# EAGLE design M-Pulse Shield V2 (EAGLE 6.4)
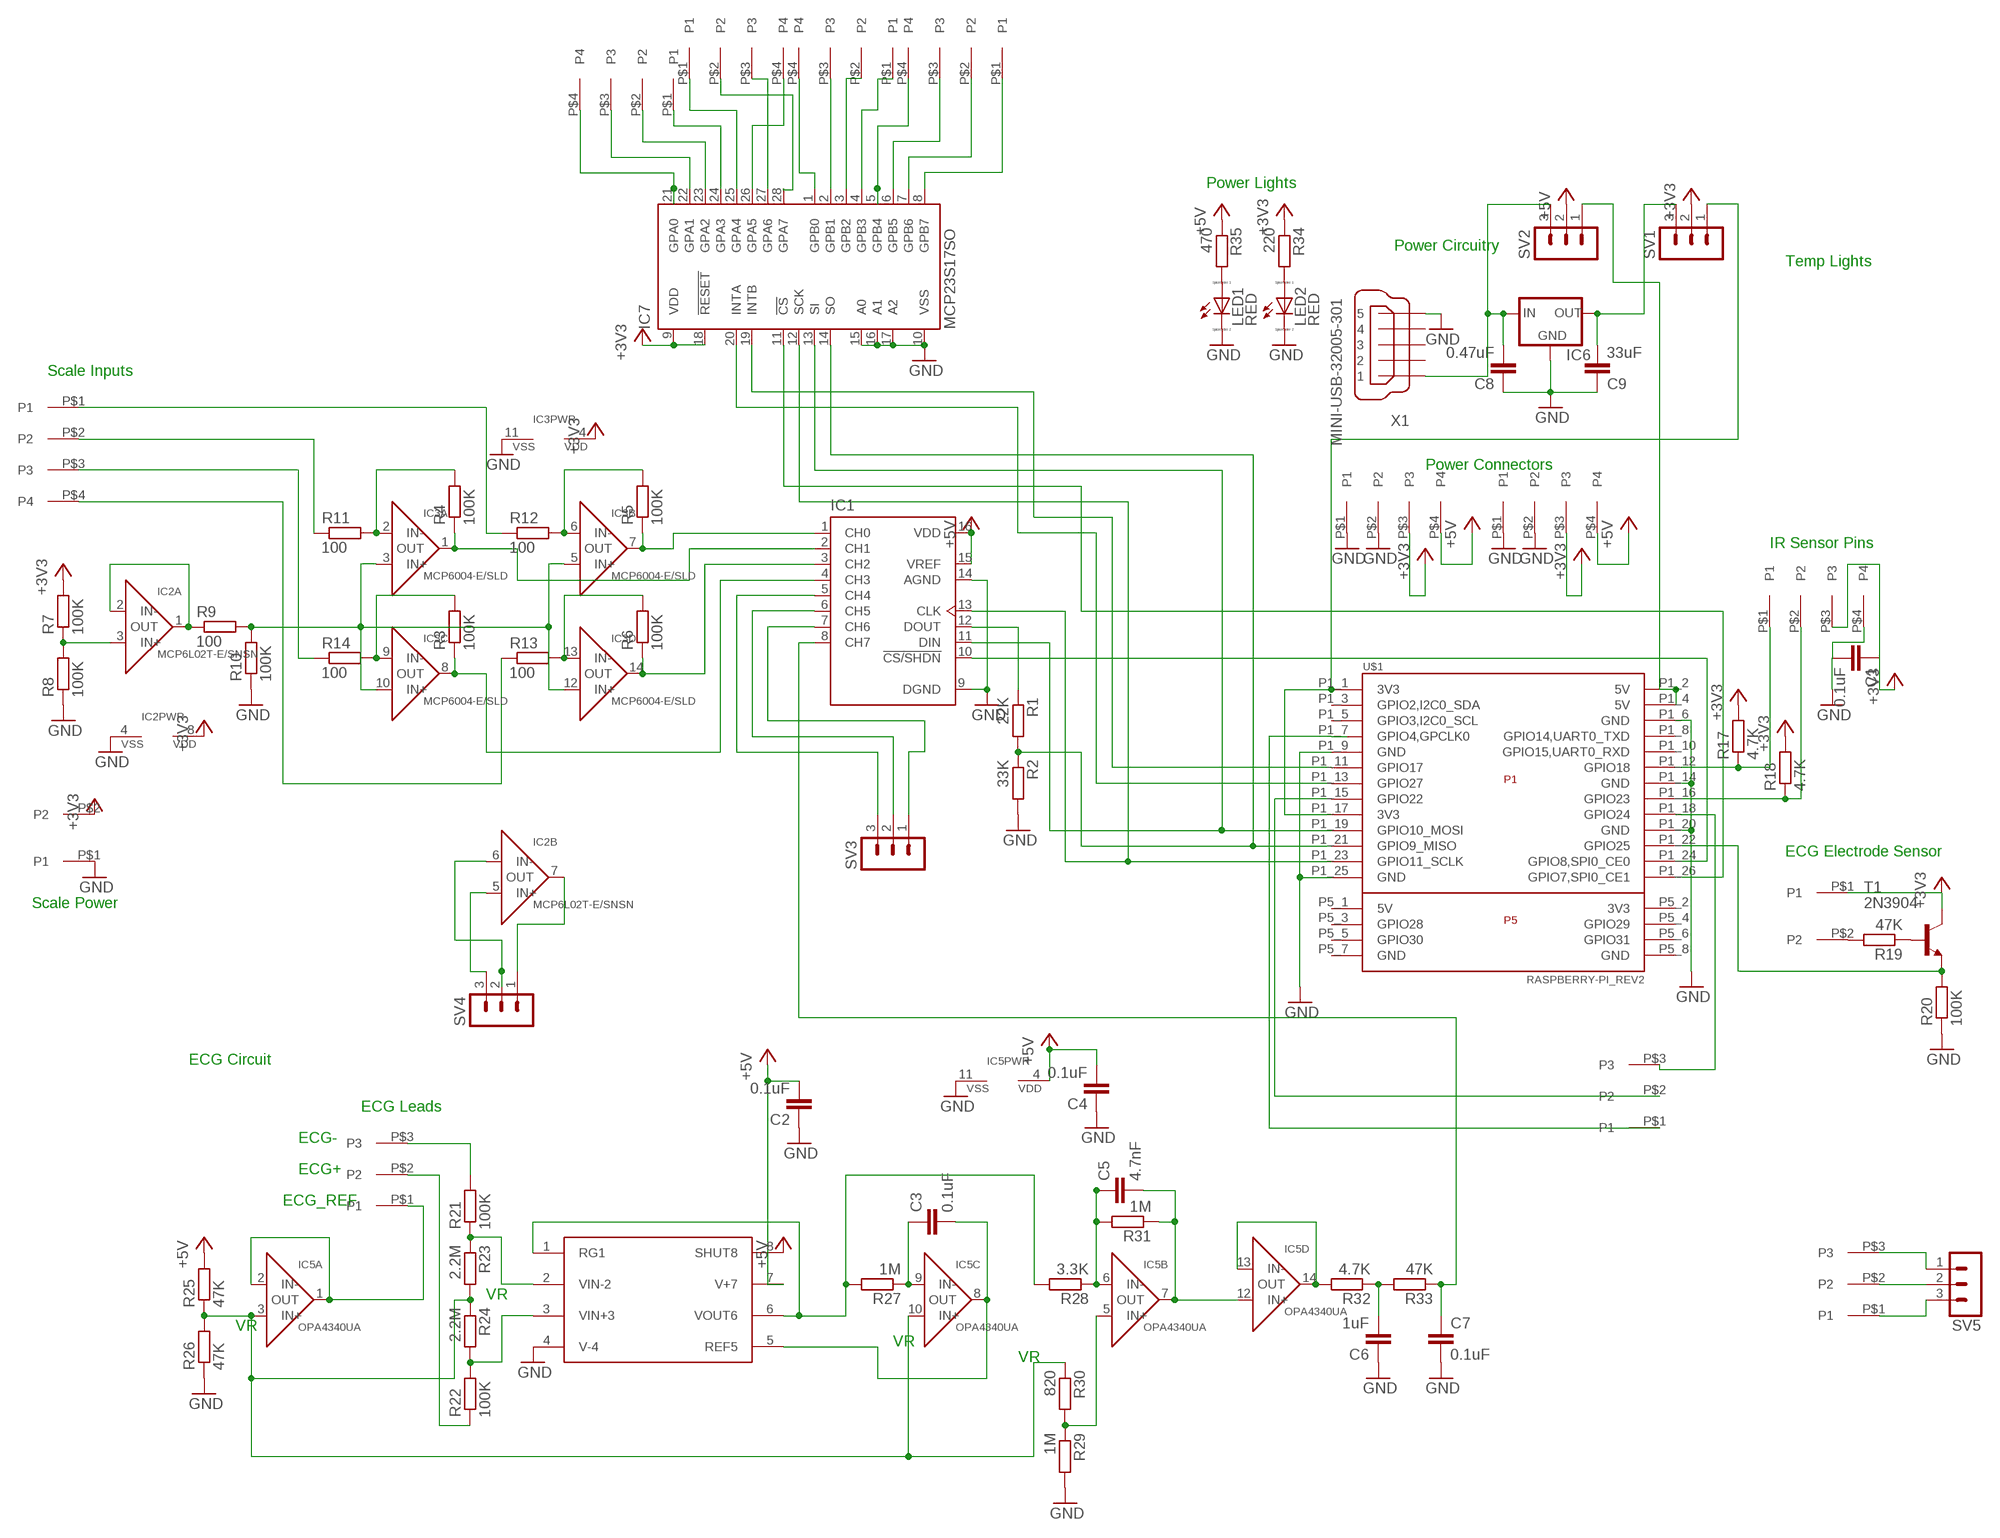
[diagram p0: schematic, sheet 1]

## Parts
C1  0.1uF  C-EUC0603  [C0603]
C2  0.1uF  C-EUC0603  [C0603]
C3  0.1uF  C-EUC0603  [C0603]
C4  0.1uF  C-EUC0603  [C0603]
C5  4.7nF  C-EUC0603  [C0603]
C6  1uF  C-EUC0603  [C0603]
C7  0.1uF  C-EUC0603  [C0603]
C8  0.47uF  C-EUC0603  [C0603]
C9  33uF  C-EUC0603  [C0603]
DIGITALPINS  1776275-3  [1776275-3]
DIGITALPINS1  1776275-3  [1776275-3]
ECG_ES  1776275-2  [1776275-2]
EKGLEADS  1776275-3  [1776275-3]
I/O1  1776275-4  [1776275-4]
I/O2  1776275-4  [1776275-4]
I/O3  1776275-4  [1776275-4]
I/O4  1776275-4  [1776275-4]
IC1  MCP3008  [SOIC16N]
IC2  MCP6L02T-E/SNSN  [SO-08]
IC3  MCP6004-E/SLD  [SO14]
IC4  INA321EAVSSOP-8  [VSSOP-8]
IC5  OPA4340UA  [SO14]
IC6  78XXL  [78XXL]
IC7  MCP23S17SO  [SO28W]
IR_I/O  1776275-4  [1776275-4]
LED1  RED  LED_E  [LED_1206]
LED2  RED  LED_E  [LED_1206]
POWEROUT  1776275-4  [1776275-4]
POWEROUT1  1776275-4  [1776275-4]
R1  22K  R-EU_R0603  [R0603]
R2  33K  R-EU_R0603  [R0603]
R3  100K  R-EU_R0603  [R0603]
R4  100K  R-EU_R0603  [R0603]
R5  100K  R-EU_R0603  [R0603]
R6  100K  R-EU_R0603  [R0603]
R7  100K  R-EU_R0603  [R0603]
R8  100K  R-EU_R0603  [R0603]
R9  100  R-EU_R0603  [R0603]
R10  100K  R-EU_R0603  [R0603]
R11  100  R-EU_R0603  [R0603]
R12  100  R-EU_R0603  [R0603]
R13  100  R-EU_R0603  [R0603]
R14  100  R-EU_R0603  [R0603]
R17  4.7K  R-EU_R0603  [R0603]
R18  4.7K  R-EU_R0603  [R0603]
R19  47K  R-EU_R0603  [R0603]
R20  100K  R-EU_R0603  [R0603]
R21  100K  R-EU_R0603  [R0603]
R22  100K  R-EU_R0603  [R0603]
R23  2.2M  R-EU_R0603  [R0603]
R24  2.2M  R-EU_R0603  [R0603]
R25  47K  R-EU_R0603  [R0603]
R26  47K  R-EU_R0603  [R0603]
R27  1M  R-EU_R0603  [R0603]
R28  3.3K  R-EU_R0603  [R0603]
R29  1M  R-EU_R0603  [R0603]
R30  820  R-EU_R0603  [R0603]
R31  1M  R-EU_R0603  [R0603]
R32  4.7K  R-EU_R0603  [R0603]
R33  47K  R-EU_R0603  [R0603]
R34  220  R-EU_R0603  [R0603]
R35  470  R-EU_R0603  [R0603]
S_IN  1776275-4  [1776275-4]
S_PWR  1776275-2  [1776275-2]
SV1  MA03-1  [MA03-1]
SV2  MA03-1  [MA03-1]
SV3  MA03-1  [MA03-1]
SV4  MA03-1  [MA03-1]
SV5  MA03-1  [MA03-1]
T1  2N3904  [TO92]
U$1  RASPBERRY-PI_REV2  [RASPBERRY-PI_REV2]
X1  MINI-USB-32005-301  [32005-301]

## Nets
+3V3: C1.1 ECG_ES.P$1(P1) IC2.8(PWR:VDD) IC3.4(PWR:VDD) IC7.9(VDD) IC7.18(!RESET) IR_I/O.P$3(P3) POWEROUT1.P$3(P3) POWEROUT.P$3(P3) R7.2 R17.2 R18.2 R34.1 S_PWR.P$2(P2) SV1.2 T1.1(C)
+5V: C2.2 C4.2 IC1.15(VREF) IC1.16(VDD) IC4.7(V+7) IC4.8(SHUT8) IC5.4(PWR:VDD) POWEROUT1.P$4(P4) POWEROUT.P$4(P4) R25.2 R35.1 SV2.2
GND: C1.2 C2.1 C4.1 C6.1 C7.2 C8.1 C9.1 IC1.9(DGND) IC1.14(AGND) IC2.4(PWR:VSS) IC3.11(PWR:VSS) IC4.4(V-4) IC5.11(PWR:VSS) IC6.GND IC7.10(VSS) IC7.15(A0) IC7.16(A1) IC7.17(A2) IR_I/O.P$4(P4) LED1.C LED2.C POWEROUT1.P$1(P1) POWEROUT1.P$2(P2) POWEROUT.P$1(P1) POWEROUT.P$2(P2) R2.2 R8.1 R10.1 R20.1 R26.1 R29.2 S_PWR.P$1(P1) U$1.P1_6(GND) U$1.P1_9(GND) U$1.P1_14(GND) U$1.P1_20(GND) U$1.P1_25(GND) X1.5
N$1: IC7.14(SO) R1.2 R2.1 U$1.P1_21(GPIO9_MISO)
N$2: IC1.13(CLK) IC7.12(SCK) U$1.P1_23(GPIO11_SCLK)
N$3: IC1.12(DOUT) R1.1
N$4: IC1.11(DIN) IC7.13(SI) U$1.P1_19(GPIO10_MOSI)
N$5: IC1.10(!CS/SHDN) U$1.P1_24(GPIO8,SPI0_CE0)
N$6: IC3.3(A:IN+) IC3.5(B:IN+) IC3.10(C:IN+) IC3.12(D:IN+) R9.2 R10.2
N$7: R12.1 S_IN.P$1(P1)
N$8: R11.1 S_IN.P$2(P2)
N$9: IC1.4(CH3) IC3.8(C:OUT) R3.1
N$10: IC1.3(CH2) IC3.14(D:OUT) R6.1
N$11: IC1.2(CH1) IC3.1(A:OUT) R4.1
N$12: I/O1.P$4(P4) IC7.21(GPA0)
N$13: IC3.2(A:IN-) R4.2 R11.2
N$14: IC3.6(B:IN-) R5.2 R12.2
N$15: IC3.13(D:IN-) R6.2 R13.2
N$16: IC3.9(C:IN-) R3.2 R14.2
N$17: R13.1 S_IN.P$4(P4)
N$18: R14.1 S_IN.P$3(P3)
N$19: IC2.3(A:IN+) R7.1 R8.2
N$20: IC2.1(A:OUT) IC2.2(A:IN-) R9.1
N$21: IC2.6(B:IN-) SV4.2
N$22: IC2.5(B:IN+) SV4.3
N$23: IR_I/O.P$1(P1) R17.1 U$1.P1_12(GPIO18)
N$24: IR_I/O.P$2(P2) R18.1 U$1.P1_16(GPIO23)
N$25: R19.1 T1.2(B)
N$26: ECG_ES.P$2(P2) R19.2
N$27: R20.2 T1.3(E) U$1.P1_22(GPIO25)
N$28: IC4.2(VIN-2) R21.1 R23.1
N$29: IC5.13(D:IN-) IC5.14(D:OUT) R32.2
N$30: IC4.3(VIN+3) R22.2 R24.2
N$31: EKGLEADS.P$3(P3) R21.2
N$32: EKGLEADS.P$2(P2) R22.1
N$33: EKGLEADS.P$1(P1) IC5.1(A:OUT) IC5.2(A:IN-)
N$34: C3.1 IC5.9(C:IN-) R27.1
N$35: I/O1.P$1(P1) IC7.24(GPA3)
N$36: IC5.3(A:IN+) IC5.10(C:IN+) R23.2 R24.1 R25.1 R26.2 R30.1
N$37: IC4.1(RG1) IC4.6(VOUT6) R27.2 R28.2
N$38: IC5.5(B:IN+) R29.1 R30.2
N$39: C3.2 IC4.5(REF5) IC5.8(C:OUT)
N$40: C5.1 IC5.6(B:IN-) R28.1 R31.2
N$41: C5.2 IC5.7(B:OUT) IC5.12(D:IN+) R31.1
N$42: C6.2 R32.1 R33.2
N$43: C7.1 IC1.8(CH7) R33.1
N$44: IC1.1(CH0) IC3.7(B:OUT) R5.1
N$45: I/O1.P$2(P2) IC7.23(GPA2)
N$46: I/O1.P$3(P3) IC7.22(GPA1)
N$47: I/O2.P$4(P4) IC7.26(GPA5)
N$48: I/O2.P$1(P1) IC7.25(GPA4)
N$49: I/O2.P$2(P2) IC7.28(GPA7)
N$50: I/O2.P$3(P3) IC7.27(GPA6)
N$51: LED2.A R34.2
N$52: I/O3.P$4(P4) IC7.1(GPB0)
N$53: I/O3.P$3(P3) IC7.2(GPB1)
N$54: I/O3.P$2(P2) IC7.3(GPB2)
N$55: I/O3.P$1(P1) IC7.4(GPB3)
N$56: I/O4.P$4(P4) IC7.5(GPB4)
N$57: I/O4.P$3(P3) IC7.6(GPB5)
N$58: I/O4.P$2(P2) IC7.7(GPB6)
N$60: IC7.19(INTB) U$1.P1_11(GPIO17)
N$61: IC7.20(INTA) U$1.P1_13(GPIO27)
N$62: IC7.11(!CS) U$1.P1_26(GPIO7,SPI0_CE1)
N$63: IC1.5(CH4) SV3.3
N$64: IC1.6(CH5) SV3.2
N$65: IC1.7(CH6) SV3.1
N$66: IC2.7(B:OUT) SV4.1
N$67: DIGITALPINS.P$3(P3) U$1.P1_18(GPIO24)
N$68: DIGITALPINS.P$2(P2) U$1.P1_15(GPIO22)
N$69: DIGITALPINS.P$1(P1) U$1.P1_7(GPIO4,GPCLK0)
N$70: C8.2 IC6.IN SV2.3 X1.1
N$71: SV2.1 U$1.P1_2(5V) U$1.P1_4(5V)
N$72: C9.2 IC6.OUT SV1.3
N$73: SV1.1 U$1.P1_1(3V3) U$1.P1_17(3V3)
N$74: I/O4.P$1(P1) IC7.8(GPB7)
N$75: LED1.A R35.2
N$76: DIGITALPINS1.P$3(P3) SV5.1
N$77: DIGITALPINS1.P$1(P1) SV5.3
N$78: DIGITALPINS1.P$2(P2) SV5.2
Unconnected: U$1.P1_3(GPIO2,I2C0_SDA) U$1.P1_5(GPIO3,I2C0_SCL) U$1.P1_8(GPIO14,UART0_TXD) U$1.P1_10(GPIO15,UART0_RXD) U$1.P5_1(5V) U$1.P5_2(3V3) U$1.P5_3(GPIO28) U$1.P5_4(GPIO29) U$1.P5_5(GPIO30) U$1.P5_6(GPIO31) U$1.P5_7(GND) U$1.P5_8(GND) X1.2 X1.3 X1.4

## Notes on the sheet
- Power Lights
- Power Circuitry
- Temp Lights
- Scale Inputs
- Power Connectors
- IR Sensor Pins
- ECG Electrode Sensor
- Scale Power
- ECG Circuit
- ECG Leads
- ECG-
- ECG+
- ECG_REF
- VR
- VR
- VR
- VR

## Library data of the parts
C1-C9 = resistor:C-EU: CAPACITOR, European symbol
DIGITALPINS DIGITALPINS1 EKGLEADS = mpulseCustom:1776275-3
ECG_ES S_PWR = mpulseCustom:1776275-2
I/O1-I/O4 IR_I/O POWEROUT POWEROUT1 S_IN = mpulseCustom:1776275-4
IC1 = mpulseCustom:MCP3008: Microchip Technology
IC2 = mpulseCustom:MCP6L02T-E/SN: Low-Power, Dual Rail-To-Rail Op-Amp
IC3 = mpulseCustom:MCP6004-E/SL: Quad RR Op-AMP
IC4 = INA321EA:INA321EA
IC5 = mpulseCustom:OPA4340UA
IC6 = v-reg:78XXL: VOLTAGE REGULATOR
IC7 = microchip:MCP23S17: http://ww1.microchip.com/downloads/en/DeviceDoc/21952a.pdf Source: http://ww1.microchip.com/downloads/en/DeviceDoc/21952a.pdf; MF: MICROCHIP; MPN: MCP23S17-E/SO; OC_FARNELL: unknown; OC_NEWARK: 31K2950
LED1 LED2 = eagle-ltspice:LED_E: LED Source: http://www.osram.convergy.de Source: www.luxeon.com Source: www.kingbright.com; SPICEMODEL: NONE; SPICEPREFIX: D; SPICETYPE: diode
R1-R14 R17-R35 = resistor:R-EU_: RESISTOR, European symbol
SV1-SV5 = con-lstb:MA03-1: PIN HEADER; OC_FARNELL: unknown; OC_NEWARK: unknown
T1 = transistor:2N3904: NPN TRANSISTOR
U$1 = RaspberryPi:RASPBERRY-PI_REV2: Raspberry Pi Board <http://www.raspberrypi.org/> Jacques Lagnel V1.0 (beta) 2012 Mateusz Bawaj V1.1 (beta) 2012 Board dimension: Forum 3D model <http://www.raspberrypi.org/forum/general-discussion/mechanical-profile-3d-models?value=3d%20model&type=1&include=1&search=1&ret=all> The GPIO Connector (P1): http://elinux.org/RPi_Low-level_peripherals The GPIO Connector (P5): http://www.raspberrypi-spy.co.uk/2012/09/raspberry-pi-p5-header/
X1 = con-cypressindustries:MINI-USB-: MINI USB-B Conector Source: www.cypressindustries.com; OC_FARNELL: unknown; OC_NEWARK: unknown

## Board
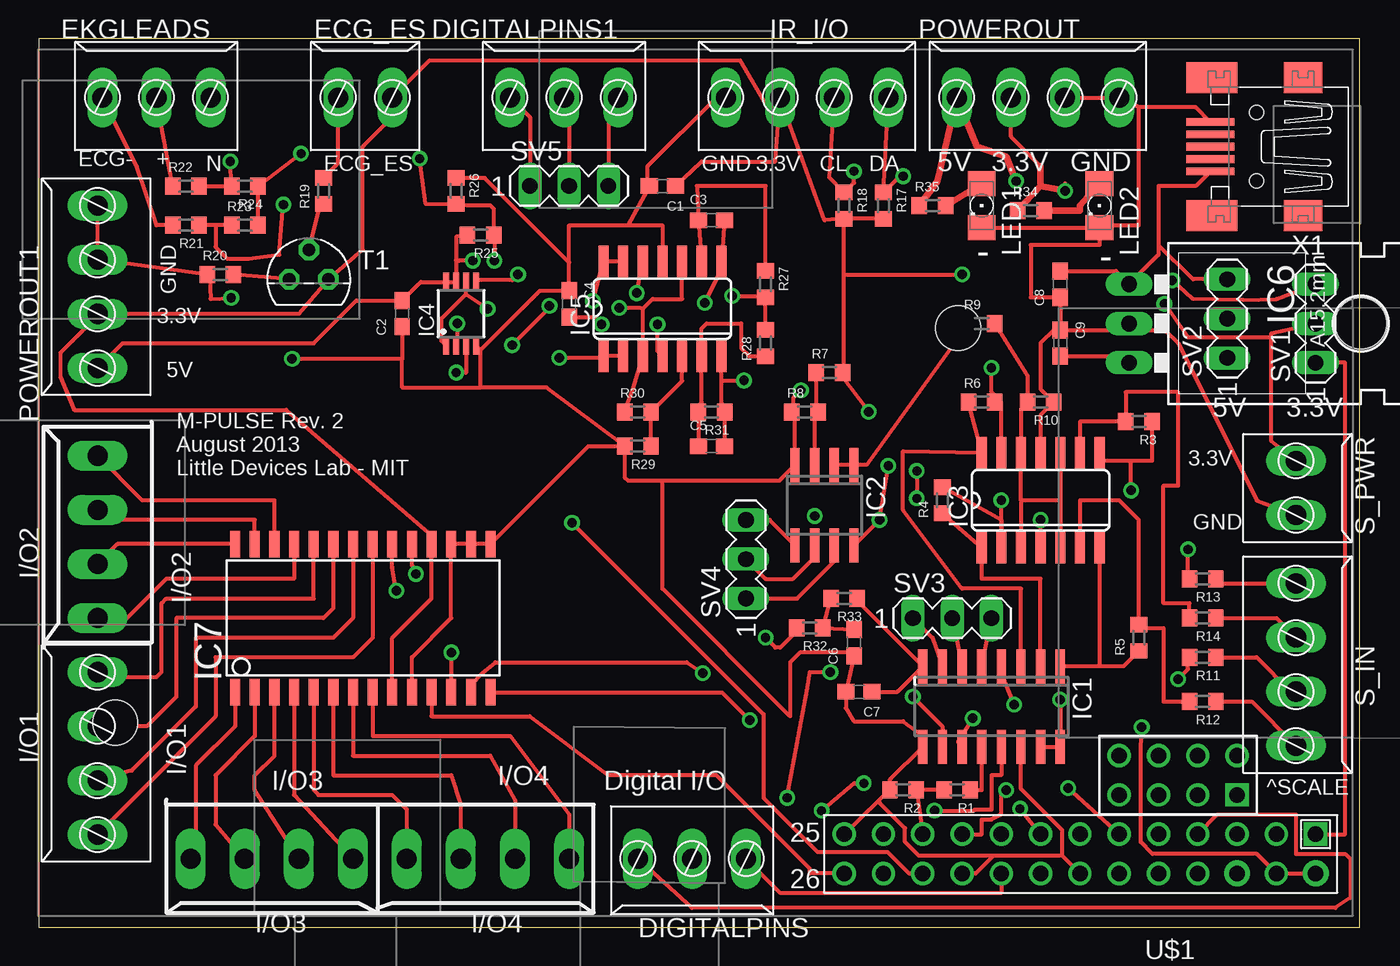
[diagram p1: board, top side]
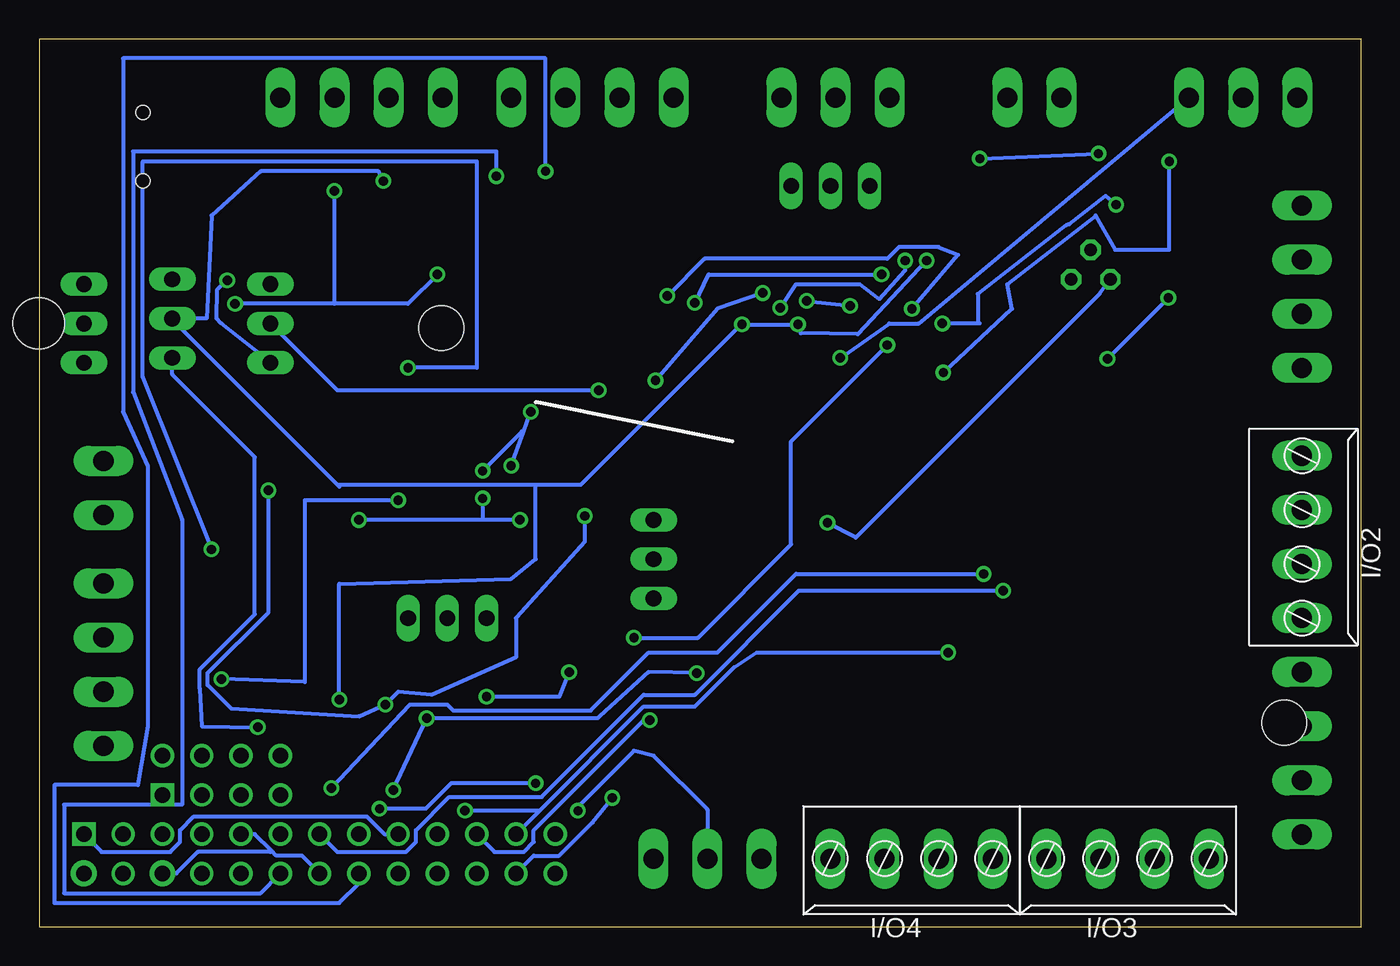
[diagram p2: board, bottom side, seen from below]

Size 85.4 x 57.45 mm. Coordinates in mm from the lower left corner, seen from the top.
Outline: 0,57.45 0,0 85.4,0 85.4,57.45 0,57.45
Copper layers (1*16): Top 0.035mm / dielectric 1.5mm / Bottom 0.035mm
Design rules "default *": minimum track width 10mil, minimum drill 23mil, track to track 10mil, track to pad 10mil, pad to pad 10mil, via to via 10mil, smd to smd 10mil, copper to edge 10mil, drill to drill 10mil, minimum pad ring 10mil, minimum via ring 8mil, stop-mask expansion 4mil, vias tented up to drill 0mil, thermal gap 10mil

### Footprints (pad centres in the part's own frame; a part is rotated, then mirrored left to right if it is on the bottom)
C0603 = smd 1.1 x 1: 1 -0.85,0; 2 0.85,0
1776275-3 = drill 1.3 pad 1.93 long: P$1 0,0; P$2 3.5,0; P$3 7,0
1776275-2 = drill 1.3 pad 1.93 long: P$1 0,0; P$2 3.5,0
1776275-4 = drill 1.3 pad 1.93 long: P$1 0,0; P$2 3.5,0; P$3 7,0; P$4 10.5,0
SOIC16N = smd 0.6 x 2.2: 1 -4.445,-2.6; 2 -3.175,-2.6; 3 -1.905,-2.6; 4 -0.635,-2.6; 5 0.635,-2.6; 6 1.905,-2.6; 7 3.175,-2.6; 8 4.445,-2.6; 9 4.445,2.6; 10 3.175,2.6; 11 1.905,2.6; 12 0.635,2.6; 13 -0.635,2.6; 14 -1.905,2.6; 15 -3.175,2.6; 16 -4.445,2.6
SO-08 = smd 0.6 x 2.2: 1 -1.905,-2.6; 2 -0.635,-2.6; 3 0.635,-2.6; 4 1.905,-2.6; 5 1.905,2.6; 6 0.635,2.6; 7 -0.635,2.6; 8 -1.905,2.6
SO14 = smd 0.66 x 2.032: 1 -3.81,-3.073; 2 -2.54,-3.073; 3 -1.27,-3.073; 4 0,-3.073; 5 1.27,-3.073; 6 2.54,-3.073; 7 3.81,-3.073; 8 3.81,3.073; 9 2.54,3.073; 10 1.27,3.073; 11 0,3.073; 12 -1.27,3.073; 13 -2.54,3.073; 14 -3.81,3.073
VSSOP-8 = smd 1.2 x 0.4: 1 -2.05,0.975; 2 -2.05,0.325; 3 -2.05,-0.325; 4 -2.05,-0.975; 5 2.05,-0.975; 6 2.05,-0.325; 7 2.05,0.325; 8 2.05,0.975
78XXL = drill 1.016 long: GND 0,-3.81; IN -2.54,-3.81; OUT 2.54,-3.81 | hole 3.302: 0,11.176
SO28W = smd 0.65 x 1.7: 1 -7.62,-4.78; 2 -6.35,-4.78; 3 -5.08,-4.78; 4 -3.81,-4.78; 5 -2.54,-4.78; 6 -1.27,-4.78; 7 0,-4.78; 8 1.27,-4.78; 9 2.54,-4.78; 10 3.81,-4.78; 11 5.08,-4.78; 12 6.35,-4.78; 13 7.62,-4.78; 14 8.89,-4.78; 15 8.89,4.78; 16 7.62,4.78; 17 6.35,4.78; 18 5.08,4.78; 19 3.81,4.78; 20 2.54,4.78; 21 1.27,4.78; 22 0,4.78; 23 -1.27,4.78; 24 -2.54,4.78; 25 -3.81,4.78; 26 -5.08,4.78; 27 -6.35,4.78; 28 -7.62,4.78
LED_1206 = smd 1.6 x 1.803: A -1.422,0; C 1.422,0
R0603 = smd 1 x 1.1: 1 -0.85,0; 2 0.85,0
MA03-1 = drill 1.016 long: 1 -2.54,0; 2 0,0; 3 2.54,0
TO92 = drill 0.813 octagon: 1 1.27,0; 2 0,1.905; 3 -1.27,0
RASPBERRY-PI_REV2 = drill 1 square: P1_1 -41.91,21.59; P5_1 -36.83,19.05 | drill 1 pad 1.676: P1_2 -41.91,24.13; P1_6 -36.83,24.13 | drill 1: P1_3 -39.37,21.59; P1_4 -39.37,24.13; P1_5 -36.83,21.59; P1_7 -34.29,21.59; P1_8 -34.29,24.13; P1_9 -31.75,21.59; P1_10 -31.75,24.13; P1_11 -29.21,21.59; P1_12 -29.21,24.13; P1_13 -26.67,21.59; P1_14 -26.67,24.13; P1_15 -24.13,21.59; P1_16 -24.13,24.13; P1_17 -21.59,21.59; P1_18 -21.59,24.13; P1_19 -19.05,21.59; P1_20 -19.05,24.13; P1_21 -16.51,21.59; P1_22 -16.51,24.13; P1_23 -13.97,21.59; P1_24 -13.97,24.13; P1_25 -11.43,21.59; P1_26 -11.43,24.13; P5_2 -36.83,16.51; P5_3 -34.29,19.05; P5_4 -34.29,16.51; P5_5 -31.75,19.05; P5_6 -31.75,16.51; P5_7 -29.21,19.05; P5_8 -29.21,16.51 | hole 2.9: 35.69,14.365; -18.81,-11.135
32005-301 = smd 3.1 x 0.5: 1 3,1.6; 2 3,0.8; 3 3,0; 4 3,-0.8; 5 3,-1.6 | smd 2.5 x 2: M1 -3,-4.45; M2 -3,4.45 | smd 3.3 x 2: M3 2.9,4.45; M4 2.9,-4.45 | hole 0.9: 0,2.2; 0,-2.2

### Placement (x,y rotation side)
C1  40.32,47.93 180 top
C2  23.5,39.67 90 top
C3  43.5,45.71 0 top
C4  34.29,40.31 270 top
C5  43.5,31.1 0 top
C6  52.7,18.4 90 top
C7  53.02,15.23 180 top
C8  66.04,41.58 90 top
C9  66.04,37.77 270 top
DIGITALPINS  38.73,4.43 0 top
DIGITALPINS1  37.47,53.64 180 top
ECG_ES  22.86,53.64 180 top
EKGLEADS  11.11,53.64 180 top
I/O1  3.81,16.5 270 top
I/O2  3.81,19.99 90 bottom
I/O3  20.32,4.43 0 bottom
I/O4  34.29,4.43 0 bottom
IC1  61.6,14.28 180 top
IC2  50.8,27.29 180 top
IC3  64.77,27.61 0 top
IC4  27.3,39.67 90 top
IC5  40.32,39.99 0 top
IC6  74.29,39.04 270 top
IC7  20.32,19.99 0 top
IR_I/O  54.93,53.64 180 top
LED1  60.96,46.66 270 top
LED2  68.58,46.66 270 top
POWEROUT  69.85,53.64 180 top
POWEROUT1  3.81,46.66 270 top
R1  59.37,8.88 180 top
R2  55.88,8.88 180 top
R3  71.12,32.69 180 top
R4  58.42,27.61 90 top
R5  71.12,18.72 90 top
R6  60.96,33.96 0 top
R7  51.12,35.87 0 top
R8  49.53,33.32 0 top
R9  60.96,39.04 0 top
R10  64.77,33.96 180 top
R11  75.25,17.45 180 top
R12  75.25,14.59 180 top
R13  75.25,22.53 180 top
R14  75.25,19.99 180 top
R17  54.61,46.66 270 top
R18  52.07,46.66 270 top
R19  18.41,47.61 90 top
R20  11.75,42.21 0 top
R21  9.52,45.39 180 top
R22  9.52,47.93 0 top
R23  13.34,45.39 0 top
R24  13.34,47.93 180 top
R25  28.57,44.75 180 top
R26  26.99,47.61 270 top
R27  46.99,41.58 270 top
R28  46.99,37.77 90 top
R29  38.73,31.1 180 top
R30  38.73,33.32 0 top
R31  43.5,33.32 180 top
R32  49.85,19.35 180 top
R33  52.07,21.26 180 top
R34  64.13,46.34 0 top
R35  57.79,46.66 0 top
S_IN  81.28,11.74 90 top
S_PWR  81.28,26.66 90 top
SV1  82.55,39.04 90 top
SV2  76.83,39.36 90 top
SV3  59.05,19.99 0 top
SV4  45.72,23.8 90 top
SV5  34.29,47.93 0 top
T1  17.46,41.9 0 top
U$1  40.64,27.61 180 top
X1  78.74,50.47 180 top

### Tracks (layer width: path | path; a pad name or v marks a point on that pad's centre or on a via)
+3V3  (via drill 0.58, 0.6, 0.61)
  Top 0.254: 64.77,49.2 62.85,51.12 POWEROUT.P$3 | R17.2 R18.2 | 52.07,42.21 52.07,35.97 R7.2 51.82,35.74 v53.66,33.32 | 52.07,42.21 R18.2 | S_PWR.P$2 79.69,31.42 79.69,38.15 | 79.69,38.15 79.69,38.41 SV1.2 | R18.2 50.8,45.71 IR_I/O.P$3 | v64.77,26.34 IC3.4 | IC2.8 52.83,24.82 v54.36,26.34 54.93,29.83 | 79.69,38.15 74.29,38.15 v72.77,40.31 | 52.07,42.21 v59.69,42.21 | 66.36,48.08 v66.36,47.61 | C1.1 42.86,49.52 47.62,49.52 IR_I/O.P$3 | IC7.9 22.86,18.72 25.4,21.26 IC7.18 25.4,25.32 16,33.45 2.29,33.45 1.4,35.61 1.4,37.13 3.81,39.55 POWEROUT1.P$3 16.81,39.66 T1.1 20.96,43.8 20.96,50.47 22.86,52.38 ECG_ES.P$1 25.27,56.06 45.34,56.06 47.12,53.01 IR_I/O.P$3 | v56.77,29.51 v56.77,27.74
  Top 0.406: R34.1 64.77,47.93 | 64.77,47.93 64.77,49.2 | 64.77,47.93 v66.36,47.61
  Bottom 0.254: v54.36,26.34 56.77,26.34 | 56.77,26.34 v64.77,26.34 | 66.36,40.31 61.6,40.31 v59.69,42.21 | 66.36,40.31 v72.77,40.31 | v66.36,47.61 66.36,40.31 | 54.93,29.83 54.13,32.02 | 54.13,32.02 v53.66,33.32 | v56.77,27.74 56.77,26.34 | v56.77,29.51 54.23,32.05 54.13,32.02
+5V  (via drill 0.6, 0.61)
  Top 0.254: IC1.15 IC1.16 v66.04,14.72 | R25.2 26.99,44.65 26.99,44.44 26.98,43.1 | 26.98,43.1 IC4.7 IC4.8 24.7,41.73 C2.2 20.54,40.52 17.78,37.77 5.42,37.77 POWEROUT1.P$4 | v40.01,38.98 40.01,37.26 40.26,37.01 IC5.4 | v28.07,43.1 27.18,43.1 26.98,43.1 | v36.38,38.98 35.94,39.42 34.29,39.42 C4.2
  Top 0.406: v63.18,48.25 62.55,49.84 60.64,50.47 POWEROUT.P$4 58.1,48.25 R35.1
  Bottom 0.254: 66.1,28.56 76.83,39.29 SV2.2 74.61,39.36 74.29,46.02 71.12,48.88 63.5,48.88 v63.18,48.25 | 66.1,28.56 66.04,28.5 | 53.34,28.63 66.04,28.63 66.1,28.56 | 53.34,28.63 50.42,28.63 40.39,38.66 v40.01,38.98 v36.38,38.98 36.2,38.41 32.51,38.34 v28.07,43.1 | v66.04,14.72 66.04,22.21 54.93,22.53 53.34,23.8 53.34,28.63
GND  (via drill 0.61)
  Top 0.254: X1.5 74.8,53.01 71.12,53.01 | 71.12,53.01 POWEROUT.P$1 POWEROUT.P$2 | C9.1 70.06,38.62 | 70.06,38.62 IC6.GND | 66.04,39.04 C9.1 | C9.1 65.62,38.62 64.77,37.77 64.77,34.81 R10.1 64.77,33.11 IC3.11 | IC7.10 24.13,17.45 26.67,19.99 IC7.17 IC7.16 IC7.15 35.54,31.1 R29.2 | LED2.C 68.73,45.39 71.12,45.39 71.12,53.01 | LED1.C LED2.C | 54.27,8.14 R2.2 55.03,9.55 IC1.9 57.15,12.37 55.88,13.32 52.7,13.32 52.17,14.17 C7.2 C6.1 52.49,17.77 49.21,17.77 48.58,17.13 48.58,13.64 40.32,21.89 40.32,28.88 | 54.27,8.14 U$1.P1_25 | POWEROUT1.P$1 POWEROUT1.P$2 R20.1 11.05,42.09 11.11,40.63 v12.45,40.69 | 28.57,34.91 23.5,34.91 23.5,36.75 | 28.57,34.91 28.57,37.33 | 28.57,37.33 IC4.4 | LED2.C 68.58,44.12 64.13,44.12 64.13,40.73 C8.1 C9.1 | 28.57,37.33 32.41,41.16 C4.1 34.29,42.98 | R29.2 32.8,34.91 28.57,34.91 | IC5.11 40.32,45.39 38.1,45.39 | 34.29,42.98 34.29,45.39 38.1,45.39 | 70.06,38.62 72.81,38.62 73.66,37.77 78.74,27.61 S_PWR.P$1 | 38.1,45.39 C1.2 39.37,48.03 39.37,49.2 43.81,53.64 IR_I/O.P$4 | IC1.14 63.5,8.94 66.17,6.27 66.17,4.62 | U$1.P1_14 66.17,4.62 | U$1.P1_20 60.58,3.48 61.66,4.56 | 61.66,4.56 61.72,4.62 66.17,4.62 | 54.27,8.14 54.36,8.05 56.01,6.4 56.01,5.51 56.9,4.62 61.6,4.62 61.66,4.56 | v49.28,34.72 48.77,34.21 48.77,33.45 R8.1 48.9,33.11 IC2.4 47.88,28.88 40.32,28.88 | C2.1 23.5,36.75 | 23.5,36.75 v16.38,36.75 | R29.2 37.88,29.09 38.1,28.88 40.32,28.88 | 34.29,42.98 28.83,48.44 27.05,48.44 R26.1
  Bottom 0.254: U$1.P1_9 71.5,6.02 70.42,4.94 | 70.42,4.94 70.1,4.62 68.45,4.62 U$1.P1_14 | U$1.P1_6 76.58,3.48 75.18,4.88 70.48,4.88 70.42,4.94 | v16.38,36.75 v12.45,40.69 | v49.28,34.72 66.17,34.72 IC6.GND
N$1  (via drill 0.61)
  Top 0.254: R1.2 R2.1 U$1.P1_21 | v45.97,13.39 44.2,15.16 29.21,15.16 IC7.14
  Bottom 0.254: v45.97,13.39 46.36,13.39 53.47,6.27 53.47,5.51 54.1,4.88 56.01,4.88 U$1.P1_21
N$2  (via drill 0.61)
  Top 0.254: v26.67,17.77 IC7.12 | v57.91,7.54 60.45,7.54 60.52,7.61 61.6,7.61 61.6,9.83 62.23,9.83 IC1.13
  Bottom 0.254: U$1.P1_23 53.15,7.48 | 53.15,7.48 46.36,14.28 43.05,14.28 40.51,16.81 39.05,17.77 v26.67,17.77 | v57.91,7.54 53.21,7.54 53.15,7.48
N$3
  Top 0.254: R1.1 60.96,8.88 IC1.12
N$4  (via drill 0.6, 0.61)
  Top 0.254: IC7.13 27.94,15.67 28.7,16.43 29.53,17.13 41.91,17.13 v42.93,16.43 | IC1.11 59.69,11.74 59.44,11.99 v60.39,13.51 | U$1.P1_19 60.96,6.02 60.96,6.97 61.6,6.97 62.23,7.29 62.23,8.56 v62.55,8.88
  Bottom 0.254: v62.55,8.88 v60.39,13.51 49.34,13.51 49.21,13.64 46.04,16.5 v42.93,16.43
N$5  (via drill 0.61)
  Top 0.254: IC1.10 58.42,13.01 v56.52,14.91 | v48.39,8.37 49.66,15.29 49.85,16.5 v51.18,16.5
  Bottom 0.254: v56.52,14.91 51.82,14.91 v51.18,16.5 | v48.39,8.37 49.66,6.78 51.82,4.62 53.47,4.62 U$1.P1_24
N$6
  Top 0.254: 66.04,27.61 IC3.5 | IC3.10 66.04,27.61 | 66.04,27.61 63.5,27.61 | 63.5,27.61 IC3.12 63.5,33.54 R10.2 63.92,35.66 R9.2 | 63.5,27.61 IC3.3
N$7
  Top 0.254: R12.1 78.42,14.59 S_IN.P$1
N$8
  Top 0.254: R11.1 78.74,17.45 80.95,15.24 S_IN.P$2
N$9  (via drill 0.61)
  Top 0.254: R3.1 71.97,30.15 70.61,30.15 | 70.61,30.15 68.58,30.15 IC3.8 | v63.06,14.4 62.1,16.69 62.23,16.81 IC1.4 | v70.61,28.24 70.61,30.15
  Bottom 0.254: v50.16,26.59 50.16,24.94 54.61,19.99 54.61,17.45 60.07,15.04 62.23,15.23 v63.06,14.4 64.77,13.64 73.02,14.15 74.55,15.67 74.55,16.43 70.61,20.37 v70.61,28.24
N$10
  Top 0.254: IC1.3 63.5,21.89 59.69,21.89 55.88,26.97 55.88,30.78 IC3.14 R6.1
N$11
  Top 0.254: R4.1 IC3.1 60.96,22.53 64.77,22.53 IC1.2
N$12
  Top 0.254: IC7.21 21.59,18.72 20.32,17.45 11.43,17.45 11.43,13.64 3.81,6.02 I/O1.P$4
N$13  (via drill 0.6, 0.61)
  Top 0.254: R4.2 62.23,26.34 IC3.2 v62.23,27.61 | v73.66,16.05 74.29,16.69 74.29,17.45 R11.2
  Bottom 0.254: v62.23,27.61 68.26,27.61 68.26,15.86 v73.66,16.05
N$14
  Top 0.254: IC3.6 67.31,27.61 69.85,27.61 71.12,26.34 R5.2 71.33,19.35 72.71,19.35 72.71,14.59 R12.2
N$15  (via drill 0.6)
  Top 0.254: 62.23,33.96 61.6,34.59 v61.6,36.18 | IC3.13 62.23,33.96 | 62.23,33.96 R6.2 | R13.2 74.29,22.63 v74.29,24.43
  Bottom 0.254: v61.6,36.18 57.15,36.18 57.15,49.52 78.74,49.52 78.74,35.55 v74.29,24.43
N$16
  Top 0.254: IC3.9 67.31,32.69 R3.2 70.27,34.59 73.66,34.59 73.66,28.56 72.71,28.56 72.71,20.94 74.4,20.94 R14.2
N$17
  Top 0.254: R13.1 76.39,22.23 S_IN.P$4
N$18
  Top 0.254: R14.1 80.01,19.99 81.27,18.73 S_IN.P$3
N$19
  Top 0.254: IC2.3 50.16,33.32 R8.2 50.27,33.32 R7.1
N$20
  Top 0.254: R9.1 53.5,29.89 IC2.1 IC2.2
N$21
  Top 0.254: IC2.6 50.16,23.93 48.77,22.53 46.99,22.53 SV4.2
N$22
  Top 0.254: SV4.3 47.25,26.34 IC2.5
N$23  (via drill 0.6)
  Top 0.254: IR_I/O.P$1 R17.1 55.66,48.56 v55.88,48.56
  Bottom 0.254: v55.88,48.56 55.88,50.15 79.38,50.15 79.38,34.59 76.2,26.34 76.2,7.93 83.82,7.93 83.82,2.21 71.12,2.21 U$1.P1_12
N$24  (via drill 0.6)
  Top 0.254: IR_I/O.P$2 51.11,48.47 R18.1 52.7,48.14 v52.7,48.88
  Bottom 0.254: v52.7,48.88 52.7,56.18 80.01,56.18 80.01,33.32 78.42,29.83 78.42,13.01 79.06,9.2 84.45,9.2 84.45,1.57 66.04,1.57 64.77,2.85 U$1.P1_16
N$25
  Top 0.254: R19.1 18.1,46.45 T1.2
N$26
  Top 0.254: R19.2 19.36,49.41 ECG_ES.P$2
N$27  (via drill 0.61)
  Top 0.254: T1.3 R20.2 | U$1.P1_22 56.26,3.48 54.86,4.88 50.36,4.88 46.86,8.37 46.86,13.77 v34.48,26.15
  Bottom 0.254: v34.48,26.15 32.64,25.2 16.89,40.95 T1.3
N$28  (via drill 0.61)
  Top 0.254: R23.1 11.43,45.39 | 11.43,45.39 R21.1 | v27.05,39.04 27.05,37.64 IC4.2 | 11.43,45.39 11.43,43.99 12.19,43.23 13.59,43.23 15.56,43.48 v15.81,46.72
  Bottom 0.254: 24.64,39.04 24.77,39.04 | 24.77,39.04 v27.05,39.04 | 24.77,39.04 24.77,40.95 19.05,45.39 18.86,45.45 16.51,47.3 v15.81,46.72
N$29  (via drill 0.6, 0.61)
  Top 0.254: IC5.13 IC5.14 36.45,42.98 v35.81,40.5 | v30.61,37.64 33.02,40.06 v33.02,40.18 | R32.2 48.9,19.35 48.9,19.04 47.94,18.08 47.62,18.08 v46.99,18.72
  Bottom 0.254: v35.81,40.5 v33.02,40.18 | v30.61,37.64 36.83,31.42 36.83,24.75 42.86,18.72 v46.99,18.72
N$30  (via drill 0.6)
  Top 0.254: R22.2 R24.2 v12.38,49.52 | IC4.3 27.62,35.87 v26.99,35.87
  Bottom 0.254: v26.99,35.87 22.54,39.99 22.86,41.58 17.14,46.02 15.88,43.8 12.38,43.8 v12.38,49.52
N$31
  Top 0.254: R21.2 7.62,45.39 6.35,49.2 EKGLEADS.P$3
N$32
  Top 0.254: R22.1 EKGLEADS.P$2
N$33  (via drill 0.6)
  Top 0.254: IC5.2 IC5.1 36.41,36.82 v33.66,36.82
  Bottom 0.254: v33.66,36.82 30.48,39.04 28.57,39.04 EKGLEADS.P$1
N$34
  Top 0.254: IC5.9 C3.1 42.55,47.93 46.99,47.93 R27.1
N$35
  Top 0.254: I/O1.P$1 4.13,16.18 7.62,16.18 7.94,16.5 7.94,20.94 8.25,21.26 17.78,21.26 IC7.24
N$36  (via drill 0.58, 0.61)
  Top 0.254: R23.2 R24.1 14.22,47.93 v16.95,50.03 | R30.1 38.42,34.81 IC5.3 39.05,39.99 | 39.05,39.99 39.69,40.63 41.59,40.63 IC5.10 | v37.53,40.06 38.86,40.06 39.05,39.99 | v29.46,43.1 29.46,44.63 R25.1 29.43,46.45 29.21,46.66 27.73,46.66 R26.2 25.02,46.79 v24.64,49.71
  Bottom 0.254: v29.46,43.1 29.46,42.47 31.12,40.63 32.38,41.58 36.51,41.58 v37.53,40.06 | v24.64,49.71 v16.95,50.03
N$37  (via drill 0.61)
  Top 0.254: R28.2 R27.2 46.86,40.82 v44.83,40.82 | IC4.1 26.04,37.92 26.04,39.36 27.63,40.95 | 27.63,40.95 IC4.6 | 27.63,40.95 v29.02,39.99
  Bottom 0.254: v44.83,40.82 42.42,43.23 30.61,43.23 29.84,43.99 27.3,43.99 26.04,43.48 v29.02,39.99
N$38
  Top 0.254: R29.1 R30.2 41.59,35.33 IC5.5
N$39  (via drill 0.61)
  Top 0.254: C3.2 IC5.8 43.94,42.98 43.94,42.21 v43.05,40.37 | v30.99,42.21 30.61,41.83 28.32,41.83 IC4.5
  Bottom 0.254: v30.99,42.21 42.16,42.21 v43.05,40.37
N$40
  Top 0.254: C5.1 R31.2 42.86,33.96 IC5.6 42.86,38.72 43.18,39.04 45.4,39.04 45.4,37.45 45.94,36.92 R28.1
N$41  (via drill 0.61)
  Top 0.254: C5.2 R31.1 44.13,33.96 44.13,35.36 | 44.13,35.36 IC5.7 | v38.67,41.01 38.99,42.98 IC5.12 | 44.13,35.36 v45.59,35.36
  Bottom 0.254: v38.67,41.01 41.59,39.99 v45.59,35.36
N$42
  Top 0.254: R33.2 R32.1 C6.2
N$43
  Top 0.254: C7.1 55.5,15.23 IC1.8 52.92,21.1 R33.1
N$44
  Top 0.254: 66.04,17.13 IC1.1 68.58,16.88 | R5.1 70.12,16.88 68.58,16.88 | IC3.7 68.58,16.88
N$45
  Top 0.254: IC7.23 19.05,20.62 18.41,19.99 8.89,19.99 8.89,14.91 6.98,13 I/O1.P$2
N$46
  Top 0.254: IC7.22 20.32,19.99 19.05,18.72 10.16,18.72 10.16,14.28 6.02,10.13 I/O1.P$3
N$47
  Top 0.254: IC7.26 15.24,27.61 6.69,27.61 I/O2.P$4
N$48
  Top 0.254: IC7.25 16.51,22.53 8.25,22.53 5.72,19.99 I/O2.P$1
N$49
  Top 0.254: IC7.28 5.09,24.77 I/O2.P$2
N$50
  Top 0.254: IC7.27 13.97,26.34 4.46,26.34 I/O2.P$3
N$51
  Top 0.406: R34.2 67.31,46.34 67.31,46.66 LED2.A
N$52
  Top 0.254: IC7.1 12.7,13.01 10.16,10.46 10.16,5.09 I/O3.P$4
N$53
  Top 0.254: IC7.2 13.97,12.37 11.43,9.83 11.43,6.64 I/O3.P$3
N$54
  Top 0.254: I/O3.P$2 13.97,8.87 13.97,9.83 15.24,11.1 IC7.3
N$55
  Top 0.254: IC7.4 16.51,8.56 I/O3.P$1
N$56
  Top 0.254: 23.79,5.09 I/O4.P$4 23.79,7.63 22.86,8.56 18.1,8.56 17.78,8.88 IC7.5
N$57
  Top 0.254: IC7.6 19.05,9.83 26.67,9.83 27.29,7.94 I/O4.P$3
N$58
  Top 0.254: IC7.7 20.32,11.1 29.21,11.1 30.79,8.25 I/O4.P$2
N$59  (via drill 0.6)
  other vias: 54.93,29.83
N$60  (via drill 0.61)
  Top 0.254: IC7.19 24.13,23.42 v24.38,22.85 | U$1.P1_11 v66.55,9
  Bottom 0.254: v66.55,9 61.47,14.4 59.05,14.4 58.67,14.02 49.78,14.02 46.04,17.77 41.59,17.77 36.51,22.85 v24.38,22.85
N$61  (via drill 0.61)
  Top 0.254: IC7.20 22.86,23.29 v23.11,21.77
  Bottom 0.254: v23.11,21.77 36.32,21.77 43.05,15.04 46.36,15.04 52.96,8.43 58.93,8.43 61.09,6.27 61.09,5.51 61.72,4.88 66.17,4.88 U$1.P1_13
N$62
  Top 0.254: IC7.11 25.4,13.64 31.75,13.64 36.83,9.83 43.81,9.83 49.85,3.8 49.85,3.48 U$1.P1_26
N$63
  Top 0.254: IC1.5 SV3.3
N$64
  Top 0.254: SV3.2 IC1.6
N$65
  Top 0.254: SV3.1 57.79,18.72 IC1.7
N$66
  Top 0.254: IC2.7 51.44,23.67 49.02,21.26 SV4.1
N$67
  Top 0.254: U$1.P1_18 62.23,2.21 47.96,2.21 DIGITALPINS.P$3
N$68  (via drill 0.58)
  Top 0.254: v63.44,7.67 U$1.P1_15 | v53.34,9.32 52.7,9.32 v50.61,7.54
  Bottom 0.254: v63.44,7.67 60.45,7.67 58.8,9.32 v53.34,9.32 | 42.29,4.5 DIGITALPINS.P$2 42.23,7.62 45.72,11.1 46.99,11.42 50.55,7.86 v50.61,7.54
N$69
  Top 0.254: U$1.P1_7 76.2,7.29 81.28,7.29 81.28,4.75 84.45,4.75 84.77,4.43 84.77,1.89 83.82,1.26 42.23,1.26 DIGITALPINS.P$1
N$70
  Top 0.254: X1.1 74.8,47.93 72.39,47.93 72.39,44.12 | 72.39,44.12 72.39,43.48 IC6.IN 69.63,42.43 C8.2 | SV2.3 74.61,41.9 72.39,44.12
N$71  (via drill 0.61)
  Top 0.254: U$1.P1_2 U$1.P1_4 78.74,4.75 72.01,4.75 71.25,5.51 71.25,11.61 v71.31,12.94
  Bottom 0.254: SV2.1 76.83,35.74 71.5,30.4 71.5,20.24 75.06,16.69 75.06,15.42 74.93,13.01 v71.31,12.94
N$72  (via drill 0.61)
  Top 0.254: C9.2 70.06,36.92 IC6.OUT | v73.28,41.83 74.61,40.63 77.85,40.56 80.01,40.63 SV1.3
  Bottom 0.254: IC6.OUT 73.66,39.04 73.98,39.36 73.93,41.24 v73.28,41.83
N$73
  Top 0.254: U$1.P1_1 84.45,6.02 84.45,36.5 SV1.1
  Bottom 0.254: U$1.P1_17 63.12,6.02 64.26,7.16 75.44,7.16 76.33,6.27 76.33,5.51 76.96,4.88 81.41,4.88 U$1.P1_1
N$74
  Top 0.254: IC7.8 21.59,12.37 30.48,12.37 34.29,7.29 I/O4.P$1
N$75
  Top 0.406: R35.2 LED1.A
N$76
  Top 0.254: SV5.1 31.75,52.38 DIGITALPINS1.P$3
N$77
  Top 0.254: SV5.3 36.83,53.01 DIGITALPINS1.P$1
N$78
  Top 0.254: SV5.2 34.29,53.39 34.04,53.64 DIGITALPINS1.P$2

### Text on the board
tPlace: ECG- | + | N | ECG_ES | GND | 3.3V | CL | DA | 5V | 3.3V | GND | - | - | GND | 3.3V | 5V | 5V | 3.3V | M-PULSE Rev. 2 / August 2013 / Little Devices Lab - MIT | 3.3V | GND | I/O2 | I/O3 | I/O4 | I/O1 | Digital I/O | ^SCALE
tNames: I/O2 | I/O3 | I/O4